# Altium project QUTMS_Shutdownboard_V2_1_Base.PrjPcb (part 2 of 2)
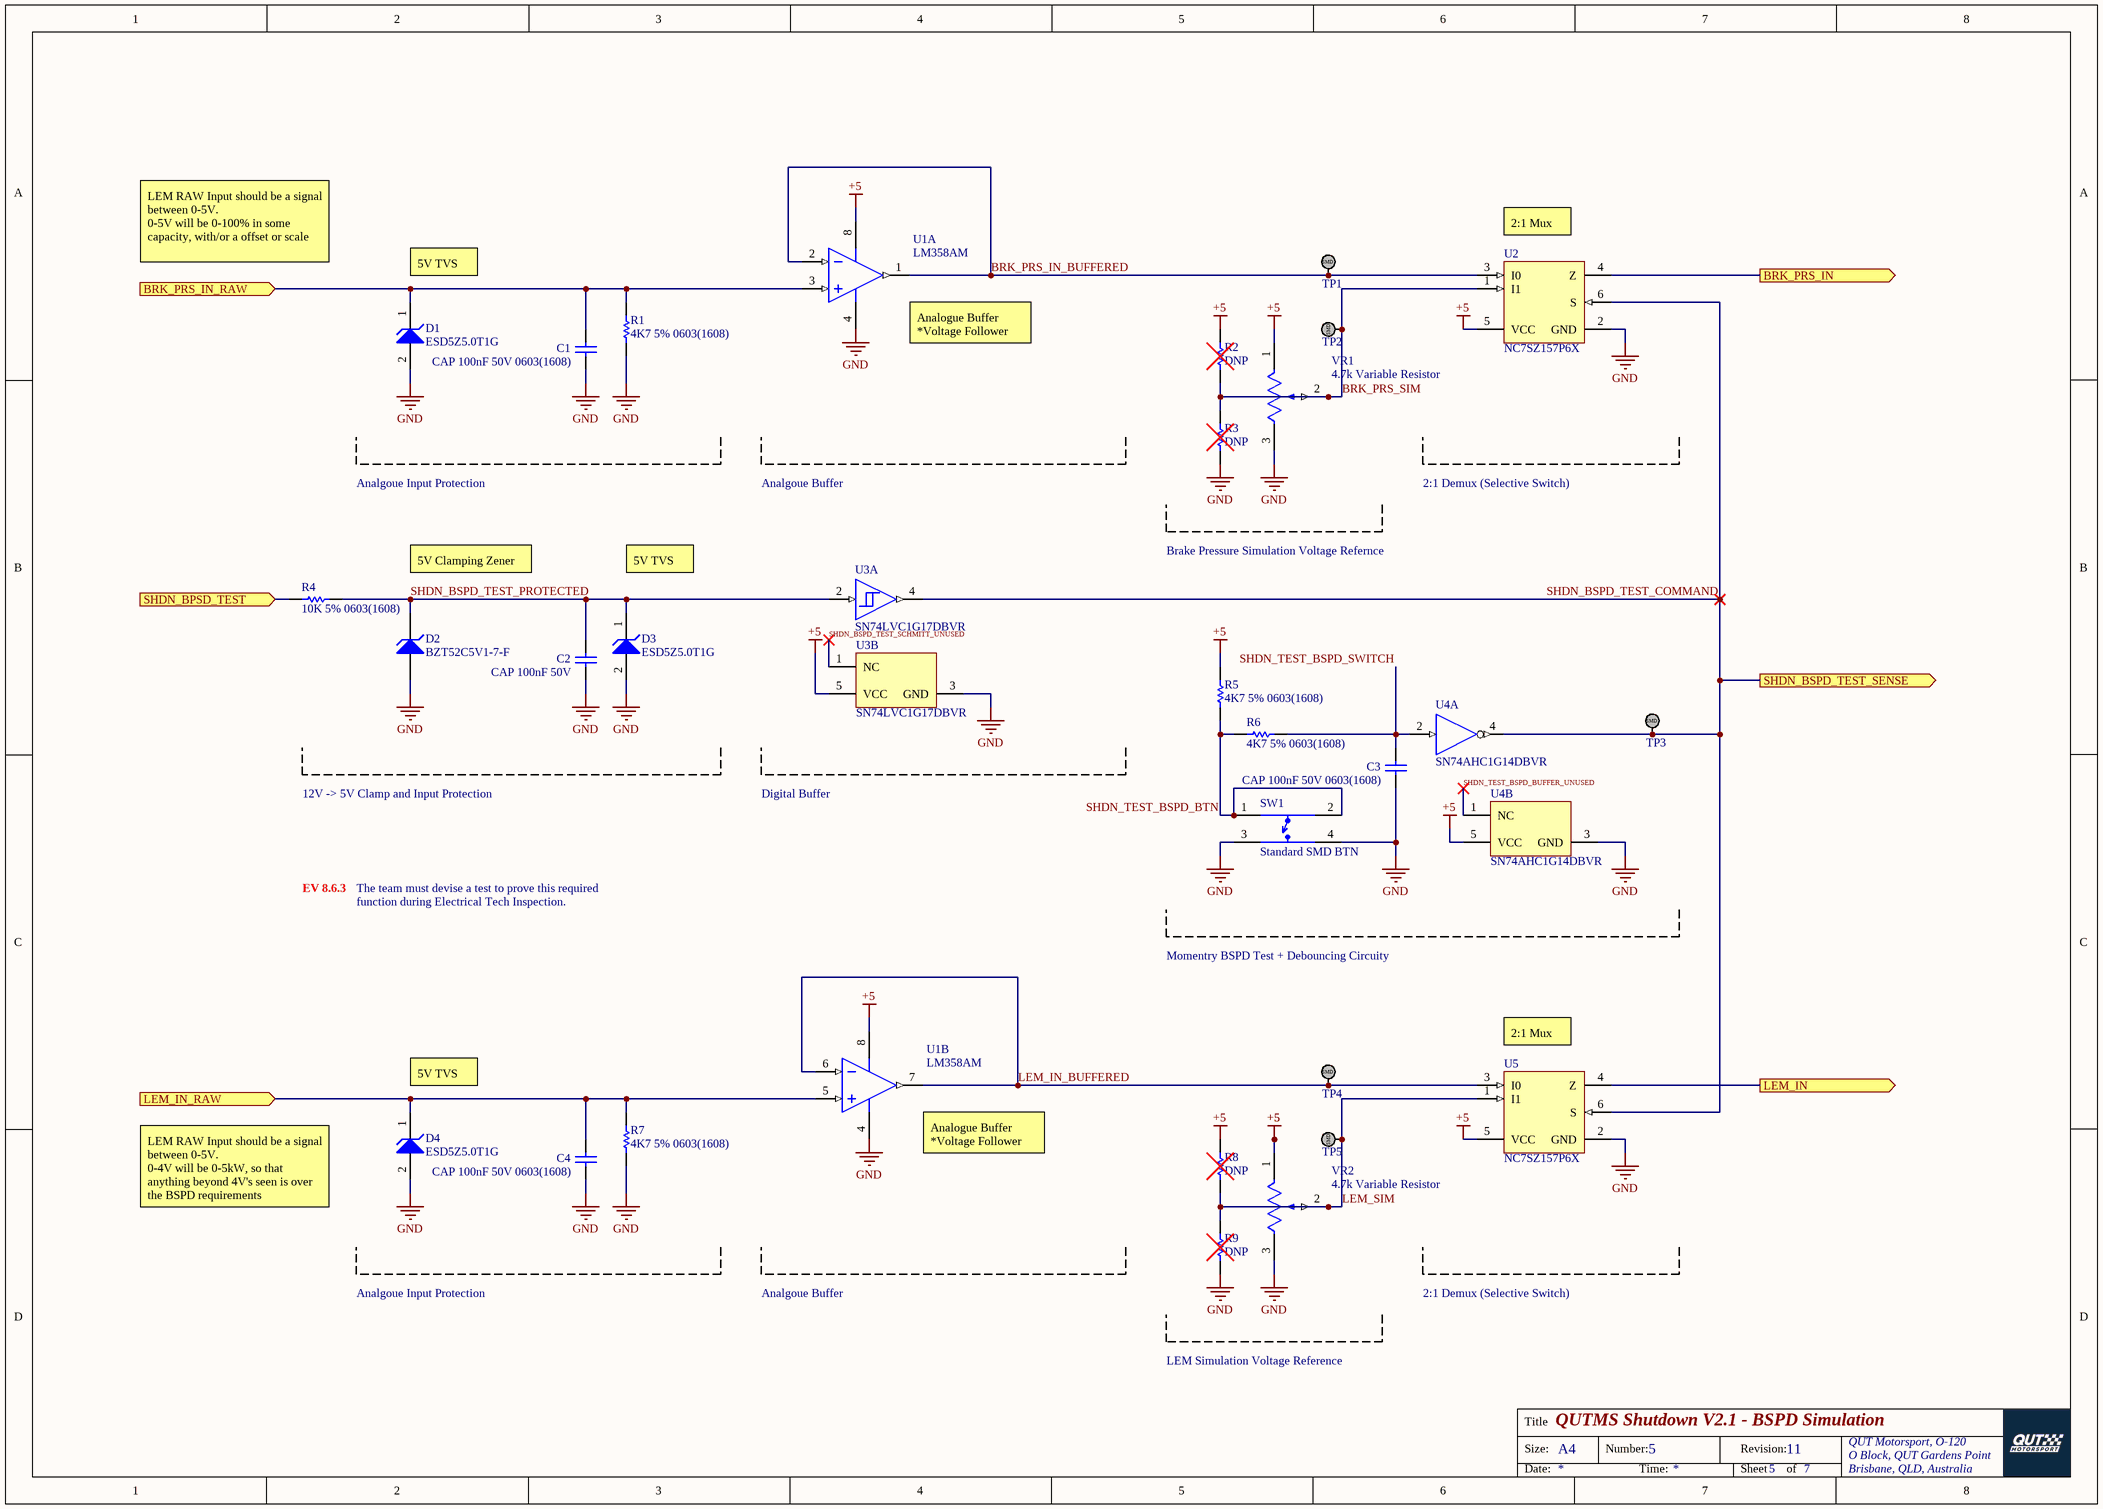
[diagram p7: BSPD_Simulation.SchDoc]

## Nets that join several sheets
+5: Master (P3.1), ShutdownLoop (6 pins), SHDN_LOOP/SHDN_SEG1 (R32_SHDN_SEG1.1), SHDN_LOOP/SHDN_SEG2 (R32_SHDN_SEG2.1), SHDN_LOOP/SHDN_SEG3 (R32_SHDN_SEG3.1), SHDN_LOOP/SHDN_SEG4 (R32_SHDN_SEG4.1), SHDN_LOOP/SHDN_SEG5 (R32_SHDN_SEG5.1), SHDN_LOOP/SHDN_SEG6 (R32_SHDN_SEG6.1), Power (C13.2 D6.1 R28.2 U12.3), BSPD_System (20 pins), BSPD_Simulation (10 pins)
+12: Power (5 pins), BSPD_System (Q1.2 Q1.4 R11.2)
GND: Master (P3.2), Connector (J1.A5), ShutdownLoop (5 pins), SHDN_LOOP/SHDN_SEG1 (D11_SHDN_SEG1.1 DS7_SHDN_SEG1.2 J2_SHDN_SEG1.12 Q4_SHDN_SEG1.2), SHDN_LOOP/SHDN_SEG2 (D11_SHDN_SEG2.1 DS7_SHDN_SEG2.2 J2_SHDN_SEG2.12 Q4_SHDN_SEG2.2), SHDN_LOOP/SHDN_SEG3 (D11_SHDN_SEG3.1 DS7_SHDN_SEG3.2 J2_SHDN_SEG3.12 Q4_SHDN_SEG3.2), SHDN_LOOP/SHDN_SEG4 (D11_SHDN_SEG4.1 DS7_SHDN_SEG4.2 J2_SHDN_SEG4.12 Q4_SHDN_SEG4.2), SHDN_LOOP/SHDN_SEG5 (D11_SHDN_SEG5.1 DS7_SHDN_SEG5.2 J2_SHDN_SEG5.12 Q4_SHDN_SEG5.2), SHDN_LOOP/SHDN_SEG6 (D11_SHDN_SEG6.1 DS7_SHDN_SEG6.2 J2_SHDN_SEG6.12 Q4_SHDN_SEG6.2), Power (8 pins), BSPD_System (27 pins), BSPD_Simulation (21 pins)
VCC: Connector (J1.A8), Power (D7.2 Q3.4)
BMS_IN: Master (P3.12), Connector (J1.A10), SHDN_LOOP/SHDN_SEG3 (J2_SHDN_SEG3.9 K1_SHDN_SEG3.4)
BRK_PRS_IN: Master (P4.2), BSPD_System (C6.1 U9.2 U9.5), BSPD_Simulation (U2.4)
BRK_PRS_IN_RAW: Connector (J1.A12), BSPD_Simulation (C1.1 D1.1 R1.2 U1.3)
CAN_N: Master (P3.4), Connector (J1.A6)
CAN_P: Master (P3.3), Connector (J1.A7)
HVD_IN: Master (P3.16), Connector (J1.A11), SHDN_LOOP/SHDN_SEG1 (J2_SHDN_SEG1.9 K1_SHDN_SEG1.4)
IMD_IN: Master (P3.14), Connector (J1.A3), SHDN_LOOP/SHDN_SEG2 (J2_SHDN_SEG2.9 K1_SHDN_SEG2.4)
LEM_IN: Master (P4.3), BSPD_System (C10.1 U10.2 U10.5), BSPD_Simulation (U5.4)
LEM_IN_RAW: Connector (J1.A2), BSPD_Simulation (C4.1 D4.1 R7.2 U1.5)
PDOC_IN: Master (P3.10), Connector (J1.A4), SHDN_LOOP/SHDN_SEG4 (J2_SHDN_SEG4.9 K1_SHDN_SEG4.4)
SDC_IN: Master (P3.6), Connector (J1.A9), SHDN_LOOP/SHDN_SEG6 (J2_SHDN_SEG6.9 K1_SHDN_SEG6.4)
SHDN_BPSD_TEST: Connector (J1.A1), BSPD_Simulation (R4.2)
SHDN_BRAKE_OVERTRAVEL: Master (P4.4), Connector (J1.B6)
SHDN_BSPD_TEST_COMMAND: Master (P4.1), BSPD_Simulation (5 pins)
SHDN_DASH_INERTIA: Master (P4.5), Connector (J1.B7)
SHDN_ESTOP_DASH: Master (P4.6), Connector (J1.B5)
SHDN_ESTOP_LEFT: Master (P4.8), Connector (J1.B4)
SHDN_ESTOP_RIGHT: Master (P4.7), Connector (J1.B8)
SHDN_IN1: Connector (J1.B12), SHDN_LOOP/SHDN_SEG1 (J2_SHDN_SEG1.4 P2_SHDN_SEG1.1)
SHDN_IN2: SHDN_LOOP/SHDN_SEG1 (J2_SHDN_SEG1.5 P2_SHDN_SEG1.2), SHDN_LOOP/SHDN_SEG2 (J2_SHDN_SEG2.4 P2_SHDN_SEG2.1)
SHDN_IN3: SHDN_LOOP/SHDN_SEG2 (J2_SHDN_SEG2.5 P2_SHDN_SEG2.2), SHDN_LOOP/SHDN_SEG3 (J2_SHDN_SEG3.4 P2_SHDN_SEG3.1)
SHDN_IN4: SHDN_LOOP/SHDN_SEG3 (J2_SHDN_SEG3.5 P2_SHDN_SEG3.2), SHDN_LOOP/SHDN_SEG4 (J2_SHDN_SEG4.4 P2_SHDN_SEG4.1)
SHDN_IN5: SHDN_LOOP/SHDN_SEG4 (J2_SHDN_SEG4.5 P2_SHDN_SEG4.2), SHDN_LOOP/SHDN_SEG5 (J2_SHDN_SEG5.4 P2_SHDN_SEG5.1)
SHDN_IN6: SHDN_LOOP/SHDN_SEG5 (J2_SHDN_SEG5.5 P2_SHDN_SEG5.2), SHDN_LOOP/SHDN_SEG6 (J2_SHDN_SEG6.4 P2_SHDN_SEG6.1)
SHDN_OUT6: Connector (J1.B1), SHDN_LOOP/SHDN_SEG6 (J2_SHDN_SEG6.5 P2_SHDN_SEG6.2)
SHDN_SEG_LATCH: ShutdownLoop (6 pins), SHDN_LOOP/SHDN_SEG1 (Q4_SHDN_SEG1.1), SHDN_LOOP/SHDN_SEG2 (Q4_SHDN_SEG2.1), SHDN_LOOP/SHDN_SEG3 (Q4_SHDN_SEG3.1), SHDN_LOOP/SHDN_SEG4 (Q4_SHDN_SEG4.1), SHDN_LOOP/SHDN_SEG5 (Q4_SHDN_SEG5.1), SHDN_LOOP/SHDN_SEG6 (Q4_SHDN_SEG6.1)
SHDN_UPRIGHT_BL: Master (P4.10), Connector (J1.B3)
SHDN_UPRIGHT_BR: Master (P4.9), Connector (J1.B9)
SHDN_UPRIGHT_FL: Master (P4.12), Connector (J1.B2)
SHDN_UPRIGHT_FR: Master (P4.11), Connector (J1.B10)
SHUTDOWN_RESET: Connector (J1.B11), ShutdownLoop (R30.1)
STATE_SENSE1: Master (P3.15), SHDN_LOOP/SHDN_SEG1 (6 pins)
STATE_SENSE2: Master (P3.13), SHDN_LOOP/SHDN_SEG2 (6 pins)
STATE_SENSE3: Master (P3.11), SHDN_LOOP/SHDN_SEG3 (6 pins)
STATE_SENSE4: Master (P3.9), SHDN_LOOP/SHDN_SEG4 (6 pins)
STATE_SENSE5: Master (P3.7), SHDN_LOOP/SHDN_SEG5 (6 pins)
STATE_SENSE6: Master (P3.5), SHDN_LOOP/SHDN_SEG6 (6 pins)
STATE_TRIGGER5: Master (P3.8), SHDN_LOOP/SHDN_SEG5 (J2_SHDN_SEG5.9 K1_SHDN_SEG5.4), BSPD_System (Q1.3)